# EAGLE schematic Finalized Dashboard (EAGLE 7.6.0)
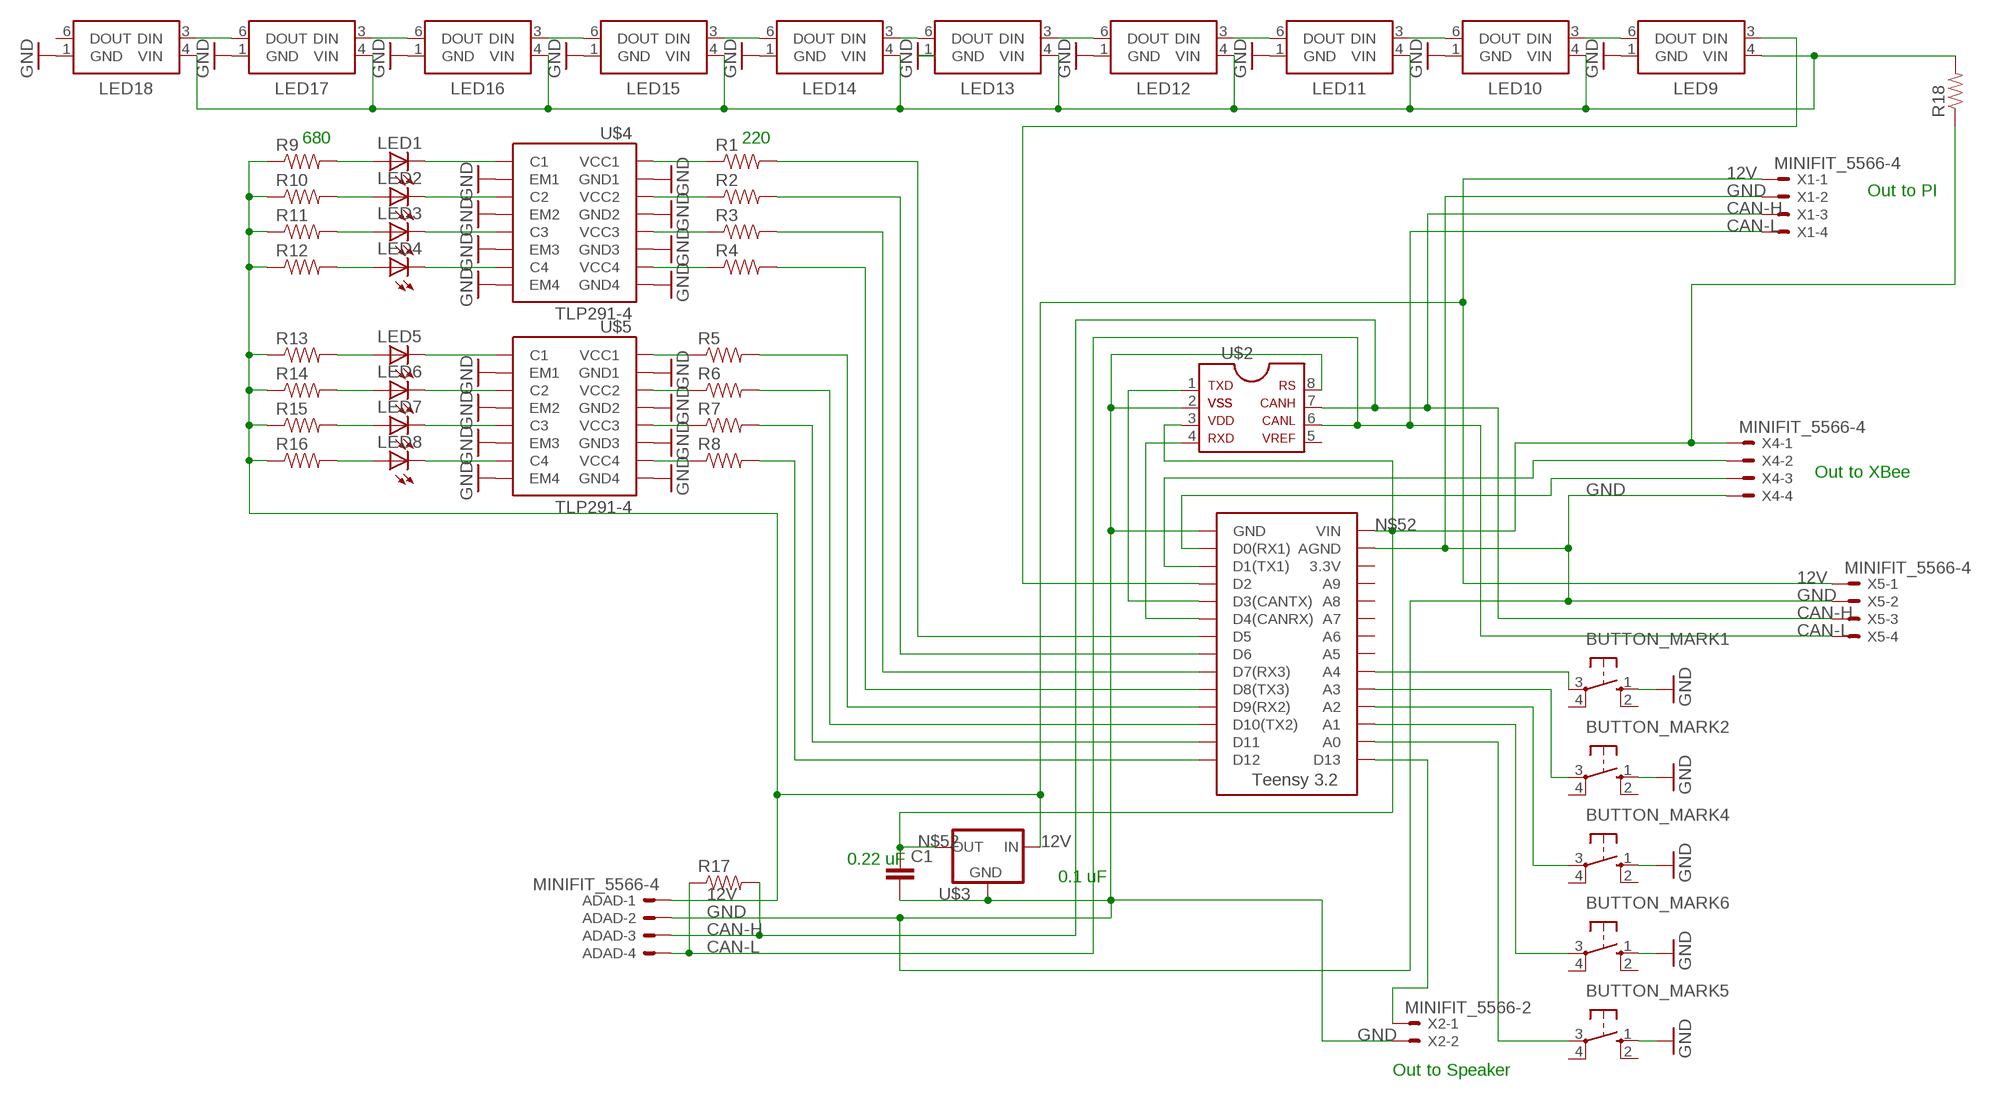
[diagram p0: schematic, sheet 1]

## Parts
ADAD  MINIFIT_5566-4  [MINIFIT_5566-4]
BUTTON_MARK1  BTN_10-XX  [B3F-10XX]
BUTTON_MARK2  BTN_10-XX  [B3F-10XX]
BUTTON_MARK4  BTN_10-XX  [B3F-10XX]
BUTTON_MARK5  BTN_10-XX  [B3F-10XX]
BUTTON_MARK6  BTN_10-XX  [B3F-10XX]
C1  CAPEZ  [CAP-PTH-SMALLEZ]
LED1  LED-5MM  [LED-5MM]
LED2  LED-5MM  [LED-5MM]
LED3  LED-5MM  [LED-5MM]
LED4  LED-5MM  [LED-5MM]
LED5  LED-5MM  [LED-5MM]
LED6  LED-5MM  [LED-5MM]
LED7  LED-5MM  [LED-5MM]
LED8  LED-5MM  [LED-5MM]
LED9  WS2812B5050  [RGBLED5050]
LED10  WS2812B5050  [RGBLED5050]
LED11  WS2812B5050  [RGBLED5050]
LED12  WS2812B5050  [RGBLED5050]
LED13  WS2812B5050  [RGBLED5050]
LED14  WS2812B5050  [RGBLED5050]
LED15  WS2812B5050  [RGBLED5050]
LED16  WS2812B5050  [RGBLED5050]
LED17  WS2812B5050  [RGBLED5050]
LED18  WS2812B5050  [RGBLED5050]
R1  RESISTORAXIAL-0.3  [AXIAL-0.3]
R2  RESISTORAXIAL-0.3  [AXIAL-0.3]
R3  RESISTORAXIAL-0.3  [AXIAL-0.3]
R4  RESISTORAXIAL-0.3  [AXIAL-0.3]
R5  RESISTORAXIAL-0.3  [AXIAL-0.3]
R6  RESISTORAXIAL-0.3  [AXIAL-0.3]
R7  RESISTORAXIAL-0.3  [AXIAL-0.3]
R8  RESISTORAXIAL-0.3  [AXIAL-0.3]
R9  RESISTORAXIAL-0.3  [AXIAL-0.3]
R10  RESISTORAXIAL-0.3  [AXIAL-0.3]
R11  RESISTORAXIAL-0.3  [AXIAL-0.3]
R12  RESISTORAXIAL-0.3  [AXIAL-0.3]
R13  RESISTORAXIAL-0.3  [AXIAL-0.3]
R14  RESISTORAXIAL-0.3  [AXIAL-0.3]
R15  RESISTORAXIAL-0.3  [AXIAL-0.3]
R16  RESISTORAXIAL-0.3  [AXIAL-0.3]
R17  RESISTORAXIAL-0.3  [AXIAL-0.3]
R18  RESISTORAXIAL-0.3  [AXIAL-0.3]
U$1  TEENSY_3.2_SIMPLE  [TEENSY_3.2_SIMPLE]
U$2  MCP2551  [SOIC-08]
U$3  5V_REGULATOR_LM340-NLM340MPX-5.0/NOPB  [SOT223]
U$4  TLP291-4  [SOIC-16]
U$5  TLP291-4  [SOIC-16]
X1  MINIFIT_5566-4  [MINIFIT_5566-4]
X2  MINIFIT_5566-2  [MINIFIT_5566-2]
X4  MINIFIT_5566-4  [MINIFIT_5566-4]
X5  MINIFIT_5566-4  [MINIFIT_5566-4]

## Nets
5V: LED9.4(VIN) LED10.4(VIN) LED11.4(VIN) LED12.4(VIN) LED13.4(VIN) LED14.4(VIN) LED15.4(VIN) LED16.4(VIN) LED17.4(VIN) LED18.4(VIN) R18.P$2
12V: ADAD.1 R9.P$1 R10.P$1 R11.P$1 R12.P$1 R13.P$1 R14.P$1 R15.P$1 R16.P$1 U$3.1(IN) X1.1 X5.1
CAN-H: ADAD.3 R17.P$2 U$2.7 X1.3 X5.3
CAN-L: ADAD.4 R17.P$1 U$2.6 X1.4 X5.4
GND: ADAD.2 BUTTON_MARK1.1(S) BUTTON_MARK2.1(S) BUTTON_MARK4.1(S) BUTTON_MARK5.1(S) BUTTON_MARK6.1(S) C1.2 LED9.1(GND) LED10.1(GND) LED11.1(GND) LED12.1(GND) LED13.1(GND) LED14.1(GND) LED15.1(GND) LED16.1(GND) LED17.1(GND) LED18.1(GND) U$1.AGND U$1.GND U$2.2 U$2.8 U$3.2(GND) U$3.4(GND) U$4.2(GND1) U$4.4(GND2) U$4.6(GND3) U$4.8(GND4) U$4.9(EM4) U$4.11(EM3) U$4.13(EM2) U$4.15(EM1) U$5.2(GND1) U$5.4(GND2) U$5.6(GND3) U$5.8(GND4) U$5.9(EM4) U$5.11(EM3) U$5.13(EM2) U$5.15(EM1) X1.2 X2.2 X4.4 X5.2
N$1: LED9.6(DOUT) LED10.3(DIN)
N$2: U$1.D1(TX1) X4.2
N$3: LED10.6(DOUT) LED11.3(DIN)
N$4: LED11.6(DOUT) LED12.3(DIN)
N$5: R1.P$1 U$4.1(VCC1)
N$6: LED13.6(DOUT) LED14.3(DIN)
N$7: R2.P$1 U$4.3(VCC2)
N$8: R3.P$1 U$4.5(VCC3)
N$9: U$1.D3(CANTX) U$2.1
N$10: U$1.D4(CANRX) U$2.4
N$11: R4.P$1 U$4.7(VCC4)
N$12: R5.P$1 U$5.1(VCC1)
N$13: U$1.D0(RX1) X4.3
N$14: R6.P$1 U$5.3(VCC2)
N$15: R7.P$1 U$5.5(VCC3)
N$16: R8.P$1 U$5.7(VCC4)
N$17: R1.P$2 U$1.D5
N$18: LED12.6(DOUT) LED13.3(DIN)
N$19: R3.P$2 U$1.D7(RX3)
N$20: R4.P$2 U$1.D8(TX3)
N$21: R5.P$2 U$1.D9(RX2)
N$22: R6.P$2 U$1.D10(TX2)
N$23: R7.P$2 U$1.D11
N$24: R8.P$2 U$1.D12
N$25: LED1.A R9.P$2
N$26: LED2.A R10.P$2
N$27: LED3.A R11.P$2
N$28: LED4.A R12.P$2
N$29: LED5.A R13.P$2
N$30: LED6.A R14.P$2
N$31: LED7.A R15.P$2
N$32: LED8.A R16.P$2
N$33: LED1.K(C) U$4.16(C1)
N$34: LED2.K(C) U$4.14(C2)
N$35: LED3.K(C) U$4.12(C3)
N$36: LED4.K(C) U$4.10(C4)
N$37: LED5.K(C) U$5.16(C1)
N$38: LED6.K(C) U$5.14(C2)
N$39: LED7.K(C) U$5.12(C3)
N$40: LED8.K(C) U$5.10(C4)
N$41: U$1.D13 X2.1
N$42: BUTTON_MARK1.3(P) U$1.A4
N$43: BUTTON_MARK2.3(P) U$1.A3
N$44: BUTTON_MARK4.3(P) U$1.A2
N$45: BUTTON_MARK6.3(P) U$1.A1
N$46: BUTTON_MARK5.3(P) U$1.A0
N$47: R2.P$2 U$1.D6
N$48: LED14.6(DOUT) LED15.3(DIN)
N$49: LED15.6(DOUT) LED16.3(DIN)
N$50: LED16.6(DOUT) LED17.3(DIN)
N$51: LED17.6(DOUT) LED18.3(DIN)
N$52: C1.1 R18.P$1 U$1.VIN U$2.3 U$3.3(OUT) X4.1
N$53: LED9.3(DIN) U$1.D2
Unconnected: BUTTON_MARK1.2(S1) BUTTON_MARK1.4(P1) BUTTON_MARK2.2(S1) BUTTON_MARK2.4(P1) BUTTON_MARK4.2(S1) BUTTON_MARK4.4(P1) BUTTON_MARK5.2(S1) BUTTON_MARK5.4(P1) BUTTON_MARK6.2(S1) BUTTON_MARK6.4(P1) LED18.6(DOUT) U$1.3.3V U$1.A5 U$1.A6 U$1.A7 U$1.A8 U$1.A9 U$2.5

## Notes on the sheet
- 680 | 220
- Out to PI
- Out to XBee
- 0.22 uF
- 0.1 uF
- Out to Speaker

## Library data of the parts
ADAD X1 X4 X5 = HyTechDevices:MINIFIT_5566-4: Mini-Fit Junior connector 4 pole Source: http://www.molex.com; OC_FARNELL: unknown; OC_NEWARK: unknown
BUTTON_MARK1 BUTTON_MARK2 BUTTON_MARK4-BUTTON_MARK6 = HyTechDevices:BTN_10-XX: OMRON SWITCH; MPN: B3F-1000; OC_FARNELL: 176432; OC_NEWARK: 36M3542
C1 = HyTechDevices:CAP: Capacitor Standard 0603 ceramic capacitor, and 0.1" leaded capacitor.
LED1-LED8 = HyTechDevices:LED: Light Emitting Diode Source: Dangerous Prototypes Eagle Library <https://github.com/DangerousPrototypes/Eagle_Part_Library>
LED9-LED18 = HyTechDevices:WS2812B: 4 Pin RBG LED individually addressable. Source: Adafruit
R1-R18 = HyTechDevices:RESISTOR: Resistor Basic schematic elements and footprints for 0603, 1206, and PTH resistors.
U$1 = HyTechDevices:TEENSY_3.2_SIMPLE: Simple version of the Teensy 3.2 board that only uses the 2 main rows of pins, not the inner pins or the pins opposite the usb port.
U$2 = HyTechDevices:MCP2551: MCP2551 High-Speed CAN Transceiver Product Webpage <https://www.microchip.com/wwwproducts/en/MCP2551> Datasheet <http://ww1.microchip.com/downloads/en/DeviceDoc/21667f.pdf> This device is outdated It is replaced by MCP2561. Comparison Page <https://www.microchip.com/wwwproducts/ProductCompare/MCP2551/MCP2561> Product Webpage <https://www.microchip.com/wwwproducts/en/MCP2561> Datasheet <http://ww1.microchip.com/downloads/en/DeviceDoc/20005167C.pdf>
U$3 = HyTechDevices:5V_REGULATOR_LM340-N: Voltage Regulator 5v linear voltage regulator Datasheet <http://www.mouser.com/ProductDetail/Texas-Instruments/LM340MPX-50-NOPB/?qs=X1J7HmVL2ZGZwtTFRQ9ItA%3D%3D> MAX current out: 1.5A MAX voltage in: 35V
U$4 U$5 = HyTechDevices:TLP291-4: Toshiba Quad Channel Optocoupler TLP291-4
X2 = HyTechDevices:MINIFIT_5566-2: Mini-Fit Junior connector 2 pole Source: http://www.molex.com; OC_FARNELL: 1822072; OC_NEWARK: unknown